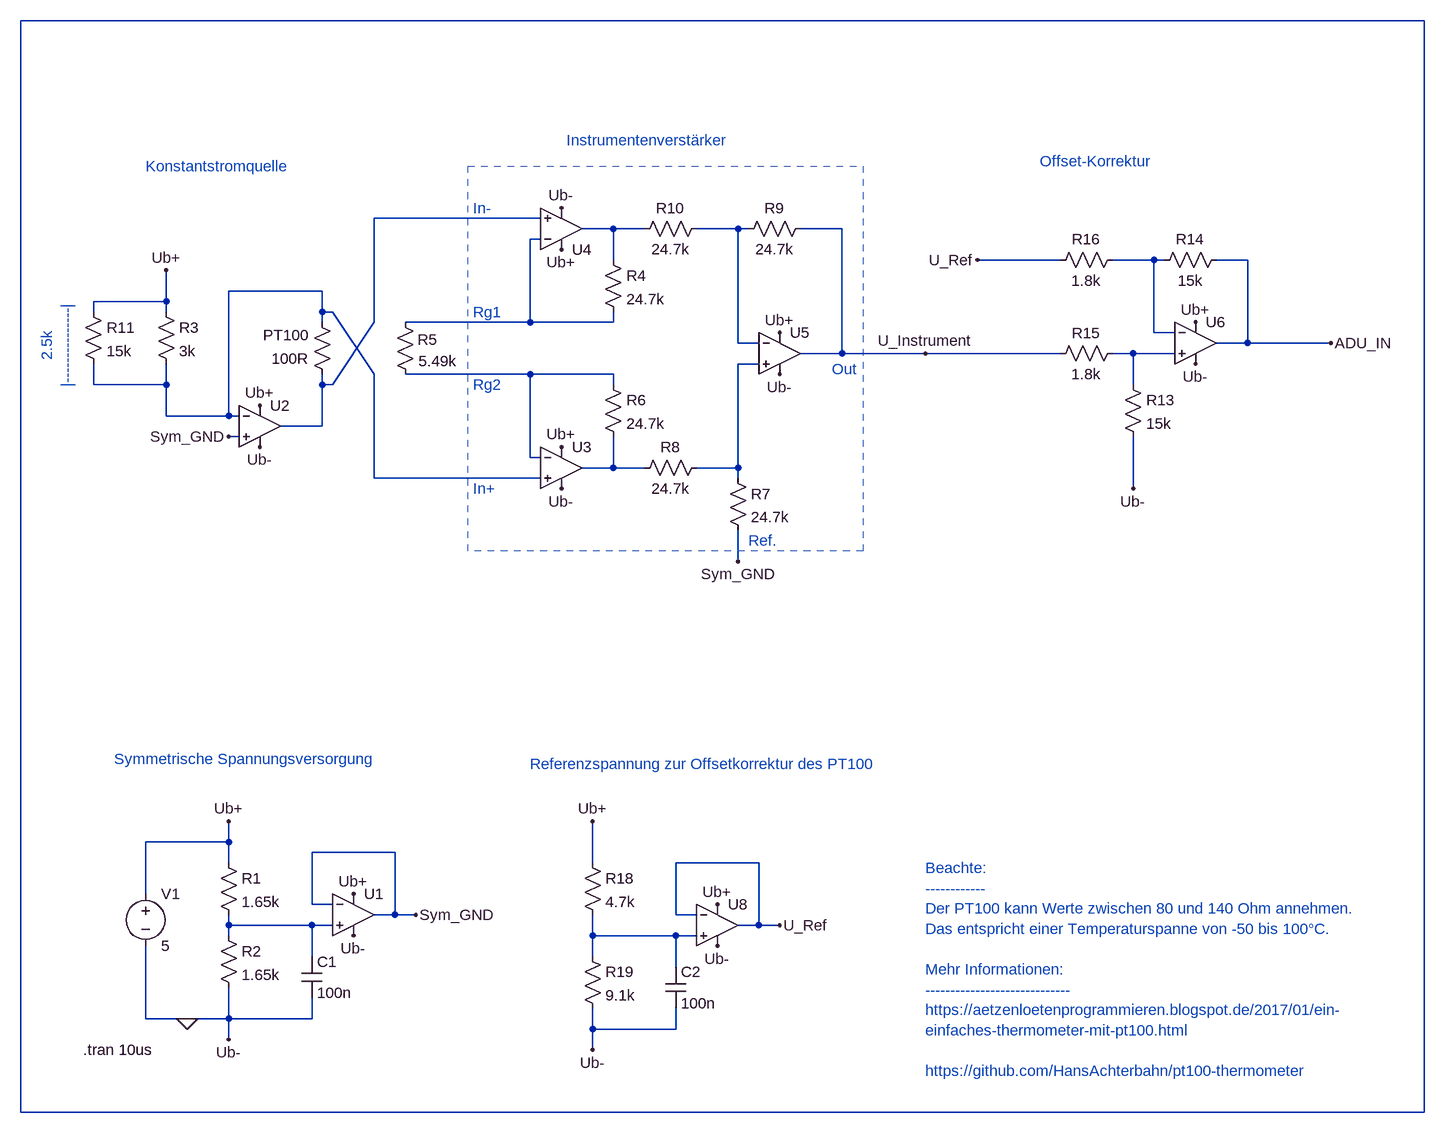
[diagram p0: schematic Thermometer-PT100-LTSpice.asc]
Thermometer-PT100-LTSpice.asc, the LTspice schematic file:
Version 4
SHEET 1 2024 892
WIRE 1840 -848 -320 -848
WIRE 288 -544 224 -544
WIRE 480 -544 288 -544
WIRE 592 -528 544 -528
WIRE 640 -528 592 -528
WIRE 784 -528 720 -528
WIRE 800 -528 784 -528
WIRE 944 -528 880 -528
WIRE 480 -512 464 -512
WIRE 592 -480 592 -528
WIRE 1216 -480 1152 -480
WIRE 1280 -480 1216 -480
WIRE 1424 -480 1360 -480
WIRE 1440 -480 1424 -480
WIRE 1568 -480 1520 -480
WIRE 64 -432 0 -432
WIRE 144 -432 64 -432
WIRE -96 -416 -96 -464
WIRE -96 -416 -208 -416
WIRE -208 -400 -208 -416
WIRE -96 -400 -96 -416
WIRE 144 -400 144 -432
WIRE 160 -400 144 -400
WIRE 144 -384 144 -400
WIRE 224 -384 224 -544
WIRE 464 -384 464 -512
WIRE 464 -384 272 -384
WIRE 592 -384 592 -400
WIRE 592 -384 464 -384
WIRE 1424 -368 1424 -480
WIRE 1456 -368 1424 -368
WIRE 784 -352 784 -528
WIRE 816 -352 784 -352
WIRE 1568 -352 1568 -480
WIRE 1568 -352 1520 -352
WIRE 1648 -352 1568 -352
WIRE 1696 -352 1648 -352
WIRE 944 -336 944 -528
WIRE 944 -336 880 -336
WIRE 1072 -336 944 -336
WIRE 1216 -336 1072 -336
WIRE 1280 -336 1216 -336
WIRE 1392 -336 1360 -336
WIRE 1456 -336 1392 -336
WIRE 816 -320 784 -320
WIRE 224 -304 160 -400
WIRE 464 -304 272 -304
WIRE 592 -304 464 -304
WIRE -208 -288 -208 -320
WIRE -96 -288 -96 -320
WIRE -96 -288 -208 -288
WIRE 144 -288 144 -304
WIRE 160 -288 224 -384
WIRE 160 -288 144 -288
WIRE 592 -288 592 -304
WIRE 1392 -288 1392 -336
WIRE -96 -240 -96 -288
WIRE 0 -240 0 -432
WIRE 0 -240 -96 -240
WIRE 16 -240 0 -240
WIRE 144 -224 144 -288
WIRE 144 -224 80 -224
WIRE 16 -208 0 -208
WIRE 464 -176 464 -304
WIRE 480 -176 464 -176
WIRE 592 -160 592 -208
WIRE 592 -160 544 -160
WIRE 640 -160 592 -160
WIRE 784 -160 784 -320
WIRE 784 -160 720 -160
WIRE 224 -144 224 -304
WIRE 288 -144 224 -144
WIRE 480 -144 288 -144
WIRE 784 -144 784 -160
WIRE 1392 -128 1392 -208
WIRE 784 -16 784 -64
WIRE 0 416 0 384
WIRE 0 416 -128 416
WIRE 256 432 128 432
WIRE 0 448 0 416
WIRE 560 448 560 384
WIRE 816 448 688 448
WIRE -128 496 -128 416
WIRE 128 512 128 432
WIRE 160 512 128 512
WIRE 256 528 256 432
WIRE 256 528 224 528
WIRE 288 528 256 528
WIRE 688 528 688 448
WIRE 720 528 688 528
WIRE 0 544 0 528
WIRE 128 544 0 544
WIRE 160 544 128 544
WIRE 816 544 816 448
WIRE 816 544 784 544
WIRE 848 544 816 544
WIRE 0 560 0 544
WIRE 560 560 560 528
WIRE 688 560 560 560
WIRE 720 560 688 560
WIRE 128 592 128 544
WIRE 560 592 560 560
WIRE 688 608 688 560
WIRE -128 688 -128 576
WIRE -64 688 -128 688
WIRE 0 688 0 640
WIRE 0 688 -64 688
WIRE 128 688 128 656
WIRE 128 688 0 688
WIRE 560 704 560 672
WIRE 688 704 688 672
WIRE 688 704 560 704
WIRE 0 720 0 688
WIRE 560 736 560 704
WIRE -320 832 -320 -848
WIRE 1840 832 1840 -848
WIRE 1840 832 -320 832
FLAG 192 496 Ub+
FLAG -96 -464 Ub+
FLAG 48 -256 Ub+
FLAG 512 -192 Ub+
FLAG 848 -368 Ub+
FLAG 192 560 Ub-
FLAG 48 -192 Ub-
FLAG 512 -128 Ub-
FLAG 512 -560 Ub-
FLAG 848 -304 Ub-
FLAG 0 384 Ub+
FLAG 0 720 Ub-
FLAG 1488 -384 Ub+
FLAG 1488 -320 Ub-
FLAG 512 -496 Ub+
FLAG 560 384 Ub+
FLAG 560 736 Ub-
FLAG 752 512 Ub+
FLAG 752 576 Ub-
FLAG 848 544 U_Ref
FLAG 1152 -480 U_Ref
FLAG 0 -208 Sym_GND
FLAG 288 528 Sym_GND
FLAG 1392 -128 Ub-
FLAG 1696 -352 ADU_IN
FLAG 1072 -336 U_Instrument
FLAG 784 -16 Sym_GND
FLAG -64 688 0
DATAFLAG 1216 -336 "round($*1000)/1000"
DATAFLAG 288 -544 "round($*1000)/1000"
DATAFLAG 288 -144 "round($*1000)/1000"
DATAFLAG 64 -432 "-round(I(Pt100)*1000)/1000"
DATAFLAG 1216 -480 "round($*1000)/1000"
DATAFLAG 1648 -352 "round($*1000)/1000"
SYMBOL res -16 432 R0
SYMATTR InstName R1
SYMATTR Value 1.65k
SYMBOL res -16 544 R0
SYMATTR InstName R2
SYMATTR Value 1.65k
SYMBOL voltage -128 480 R0
WINDOW 123 0 0 Left 2
WINDOW 39 0 0 Left 2
SYMATTR InstName V1
SYMATTR Value 5
SYMBOL Opamps\\UniversalOpamp2 192 528 R0
SYMATTR InstName U1
SYMBOL Opamps\\UniversalOpamp2 48 -224 R0
SYMATTR InstName U2
SYMBOL Opamps\\UniversalOpamp2 512 -160 R0
SYMATTR InstName U3
SYMBOL Opamps\\UniversalOpamp2 512 -528 M180
SYMATTR InstName U4
SYMBOL Opamps\\UniversalOpamp2 848 -336 R0
SYMATTR InstName U5
SYMBOL res -112 -416 R0
SYMATTR InstName R3
SYMATTR Value 3k
SYMBOL res 576 -496 R0
SYMATTR InstName R4
SYMATTR Value 24.7k
SYMBOL res 256 -400 R0
WINDOW 0 35 43 Left 2
SYMATTR InstName R5
SYMATTR Value 5.49k
SYMBOL res 576 -304 R0
SYMATTR InstName R6
SYMATTR Value 24.7k
SYMBOL res 768 -160 R0
SYMATTR InstName R7
SYMATTR Value 24.7k
SYMBOL res 896 -544 R90
WINDOW 0 0 56 VBottom 2
WINDOW 3 32 56 VTop 2
SYMATTR InstName R9
SYMATTR Value 24.7k
SYMBOL res 160 -288 R180
WINDOW 0 36 76 Left 2
WINDOW 3 36 40 Left 2
SYMATTR InstName PT100
SYMATTR Value 100R
SYMBOL res 736 -176 R90
WINDOW 0 0 56 VBottom 2
WINDOW 3 32 56 VTop 2
SYMATTR InstName R8
SYMATTR Value 24.7k
SYMBOL res 736 -544 R90
WINDOW 0 0 56 VBottom 2
WINDOW 3 32 56 VTop 2
SYMATTR InstName R10
SYMATTR Value 24.7k
SYMBOL Opamps\\UniversalOpamp2 1488 -352 R0
SYMATTR InstName U6
SYMBOL res 1536 -496 R90
WINDOW 0 0 56 VBottom 2
WINDOW 3 32 56 VTop 2
SYMATTR InstName R14
SYMATTR Value 15k
SYMBOL res 1376 -352 R90
WINDOW 0 0 56 VBottom 2
WINDOW 3 32 56 VTop 2
SYMATTR InstName R15
SYMATTR Value 1.8k
SYMBOL res 1376 -496 R90
WINDOW 0 0 56 VBottom 2
WINDOW 3 32 56 VTop 2
SYMATTR InstName R16
SYMATTR Value 1.8k
SYMBOL res 544 432 R0
SYMATTR InstName R18
SYMATTR Value 4.7k
SYMBOL res 544 576 R0
SYMATTR InstName R19
SYMATTR Value 9.1k
SYMBOL res 1376 -304 R0
SYMATTR InstName R13
SYMATTR Value 15k
SYMBOL Opamps\\UniversalOpamp2 752 544 R0
SYMATTR InstName U8
SYMBOL res -224 -416 R0
SYMATTR InstName R11
SYMATTR Value 15k
SYMBOL cap 112 592 R0
SYMATTR InstName C1
SYMATTR Value 100n
SYMBOL cap 672 608 R0
SYMATTR InstName C2
SYMATTR Value 100n
TEXT -224 736 Left 2 !.tran 10us
TEXT -128 -624 Left 2 ;Konstantstromquelle
TEXT 520 -664 Left 2 ;Instrumentenverstärker
TEXT 1248 -632 Left 2 ;Offset-Korrektur
TEXT -176 288 Left 2 ;Symmetrische Spannungsversorgung
TEXT 464 296 Left 2 ;Referenzspannung zur Offsetkorrektur des PT100
TEXT -264 -352 VCenter 2 ;2.5k \n|---------------|
TEXT 376 -560 Left 2 ;In-
TEXT 376 -128 Left 2 ;In+
TEXT 928 -312 Left 2 ;Out
TEXT 800 -48 Left 2 ;Ref.
TEXT 1072 456 Left 2 ;Beachte:\n------------\nDer PT100 kann Werte zwischen 80 und 140 Ohm annehmen.\nDas entspricht einer Temperaturspanne von -50 bis 100°C.\n \nMehr Informationen:\n-----------------------------\nhttps://aetzenloetenprogrammieren.blogspot.de/2017/01/ein-\neinfaches-thermometer-mit-pt100.html\n \nhttps://github.com/HansAchterbahn/pt100-thermometer
TEXT 376 -400 Left 2 ;Rg1
TEXT 376 -288 Left 2 ;Rg2
RECTANGLE Normal 976 -32 368 -624 2

The netlist it stands for:
* Thermometer-PT100-LTSpice.asc
R1 Ub+ N012 1.65k
R2 N012 0 1.65k
V1 Ub+ 0 5
XU1 N012 Sym_GND Ub+ 0 Sym_GND level.2 Avol=1Meg GBW=10Meg Slew=10Meg ilimit=25m rail=0 Vos=0 phimargin=45 en=0 enk=0 in=0 ink=0 Rin=500Meg  ; pins IN+ IN- V+ V- OUT
XU2 Sym_GND N007 Ub+ 0 N002 level.2 Avol=1Meg GBW=10Meg Slew=10Meg ilimit=25m rail=0 Vos=0 phimargin=45 en=0 enk=0 in=0 ink=0 Rin=500Meg  ; pins IN+ IN- V+ V- OUT
XU3 N007 N010 Ub+ 0 N011 level.2 Avol=1Meg GBW=10Meg Slew=10Meg ilimit=25m rail=0 Vos=0 phimargin=45 en=0 enk=0 in=0 ink=0 Rin=500Meg  ; pins IN+ IN- V+ V- OUT
XU4 N002 N005 Ub+ 0 N003 level.2 Avol=1Meg GBW=10Meg Slew=10Meg ilimit=25m rail=0 Vos=0 phimargin=45 en=0 enk=0 in=0 ink=0 Rin=500Meg  ; pins IN+ IN- V+ V- OUT
XU5 N009 N004 Ub+ 0 U_Instrument level.2 Avol=1Meg GBW=10Meg Slew=10Meg ilimit=25m rail=0 Vos=0 phimargin=45 en=0 enk=0 in=0 ink=0 Rin=500Meg  ; pins IN+ IN- V+ V- OUT
R3 Ub+ N007 3k
R4 N003 N005 24.7k
R5 N005 N010 5.49k
R6 N010 N011 24.7k
R7 N009 Sym_GND 24.7k
R9 U_Instrument N004 24.7k
R§PT100 N002 N007 100R
R8 N009 N011 24.7k
R10 N004 N003 24.7k
XU6 N008 N006 Ub+ 0 ADU_IN level.2 Avol=1Meg GBW=10Meg Slew=10Meg ilimit=25m rail=0 Vos=0 phimargin=45 en=0 enk=0 in=0 ink=0 Rin=500Meg  ; pins IN+ IN- V+ V- OUT
R14 ADU_IN N006 15k
R15 N008 U_Instrument 1.8k
R16 N006 U_Ref 1.8k
R18 Ub+ N013 4.7k
R19 N013 0 9.1k
R13 N008 0 15k
XU8 N013 U_Ref Ub+ 0 U_Ref level.2 Avol=1Meg GBW=10Meg Slew=10Meg ilimit=25m rail=0 Vos=0 phimargin=45 en=0 enk=0 in=0 ink=0 Rin=500Meg  ; pins IN+ IN- V+ V- OUT
R11 Ub+ N007 15k
C1 N012 0 100n
C2 N013 0 100n
.tran 10us
* Konstantstromquelle
* Instrumentenverstärker
* Offset-Korrektur
* Symmetrische Spannungsversorgung
* Referenzspannung zur Offsetkorrektur des PT100
* 2.5k
* |---------------|
* In-
* In+
* Out
* Ref.
* Beachte:
* ------------
* Der PT100 kann Werte zwischen 80 und 140 Ohm annehmen.
* Das entspricht einer Temperaturspanne von -50 bis 100°C.
* Mehr Informationen:
* -----------------------------
* https://aetzenloetenprogrammieren.blogspot.de/2017/01/ein-
* einfaches-thermometer-mit-pt100.html
* https://github.com/HansAchterbahn/pt100-thermometer
* Rg1
* Rg2
.lib UniversalOpamps2.sub
.backanno
.end